# Altium schematic sheet Regulation.SchDoc
size A3
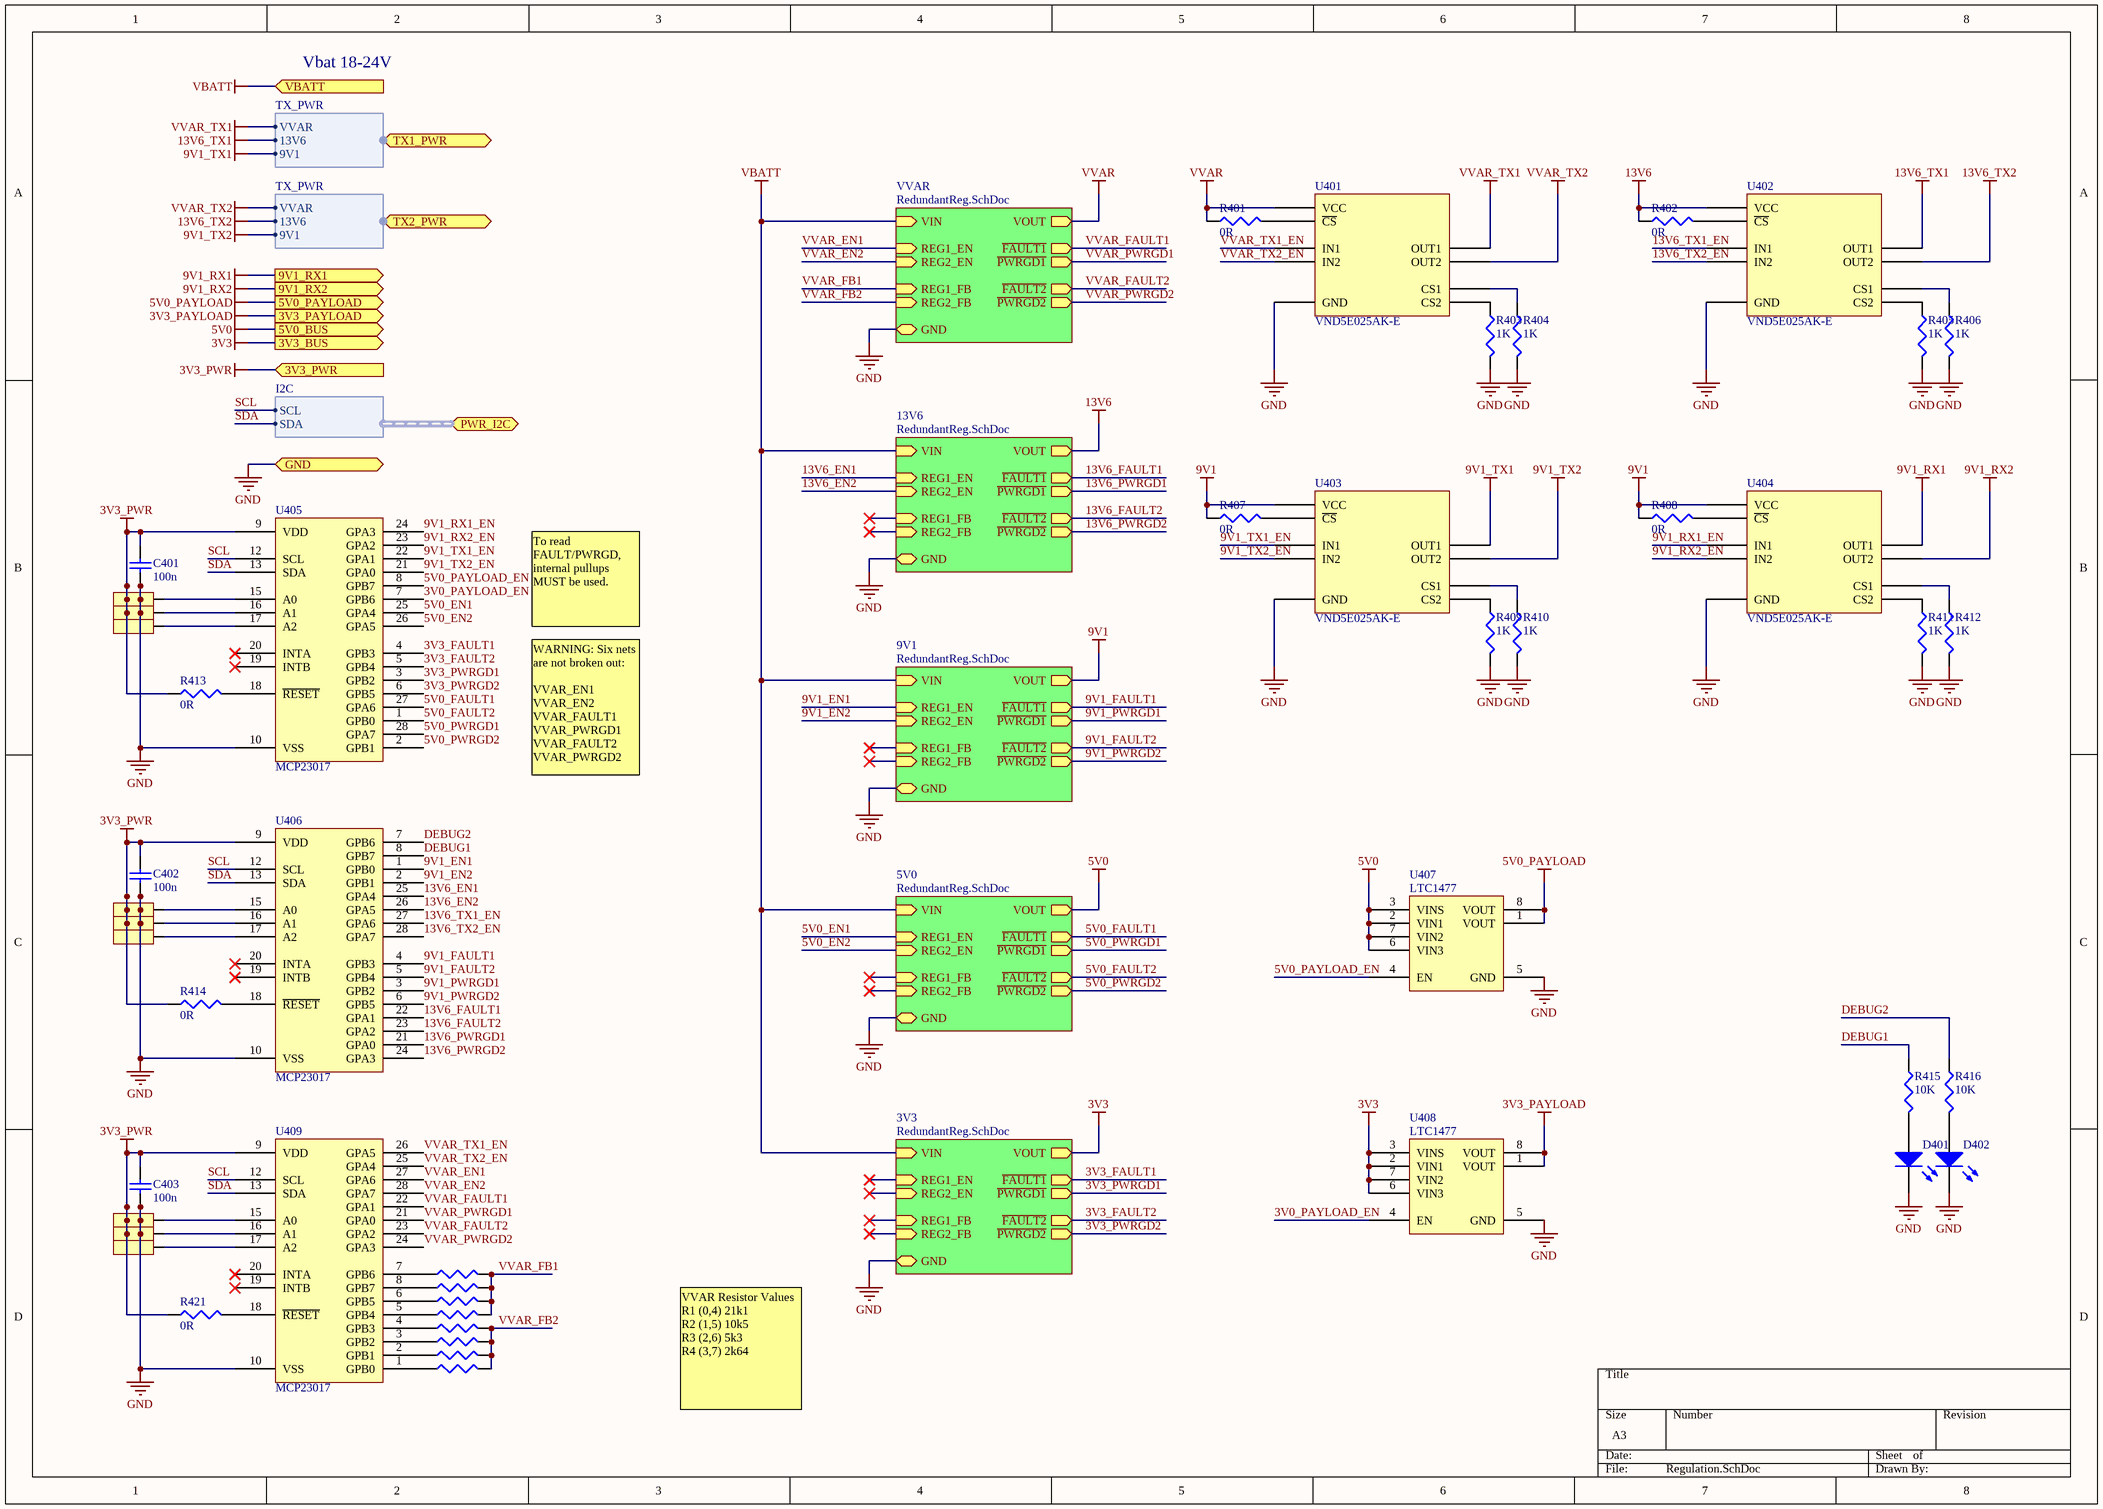
[diagram p0: Regulation.SchDoc]

## Parts
C401  value 100n  [R0805M]
C402  value 100n  [R0805M]
C403  value 100n  [R0805M]
D401  LED0  [R0805M]  (value not drawn)
D402  LED0  [R0805M]  (value not drawn)
J401  3-WAY JUMPER  [J1205M]  (value not drawn)
J402  3-WAY JUMPER  [J1205M]  (value not drawn)
J403  3-WAY JUMPER  [J1205M]  (value not drawn)
J404  3-WAY JUMPER  [J1205M]  (value not drawn)
J405  3-WAY JUMPER  [J1205M]  (value not drawn)
J406  3-WAY JUMPER  [J1205M]  (value not drawn)
J407  3-WAY JUMPER  [J1205M]  (value not drawn)
J408  3-WAY JUMPER  [J1205M]  (value not drawn)
J409  3-WAY JUMPER  [J1205M]  (value not drawn)
R401  value 0R  [R0402M]
R402  value 0R  [R0402M]
R403  value 1K  [R0402M]
R404  value 1K  [R0402M]
R405  value 1K  [R0402M]
R406  value 1K  [R0402M]
R407  value 0R  [R0402M]
R408  value 0R  [R0402M]
R409  value 1K  [R0402M]
R410  value 1K  [R0402M]
R411  value 1K  [R0402M]
R412  value 1K  [R0402M]
R413  value 0R  [R0402M]
R414  value 0R  [R0402M]
R415  value 10K  [R0402M]
R416  value 10K  [R0402M]
R417  VSET_1  [R0805M]  (value not drawn)
R418  VSET_1  [R0805M]  (value not drawn)
R419  VSET_1  [R0805M]  (value not drawn)
R420  VSET_1  [R0805M]  (value not drawn)
R421  value 0R  [R0402M]
R422  VSET_1  [R0805M]  (value not drawn)
R423  VSET_1  [R0805M]  (value not drawn)
R424  VSET_1  [R0805M]  (value not drawn)
R425  VSET_1  [R0805M]  (value not drawn)
U401  VND5E025AK-E  [SSO24]
U402  VND5E025AK-E  [SSO24]
U403  VND5E025AK-E  [SSO24]
U404  VND5E025AK-E  [SSO24]
U405  MCP23017  [SSOP28]
U406  MCP23017  [SSOP28]
U407  LTC1477  [SO8]
U408  LTC1477  [SO8]
U409  MCP23017  [SSOP28]

## Sub-sheets
3V3 = RedundantReg.SchDoc: REG1_EN (in), REG2_EN (in), VIN (in), VOUT (out), REG1_FB (in), REG2_FB (in), GND, ~{FAULT1} (out), ~{FAULT2} (out), ~{PWRGD1} (out), ~{PWRGD2} (out)  | Converter_IC_Variant: LMZ14203EXT; Value_Cout: 22uF; Value_Cout2: 22uF; Value_Isense: 0R10; Value_ON1: 10k13; Value_ON2: 3k13; Value_RFBB: 1k; Value_RFBT: 3k13; Value_RON: 51k1
5V0 = RedundantReg.SchDoc: REG1_EN (in), REG2_EN (in), VIN (in), VOUT (out), REG1_FB (in), REG2_FB (in), GND, ~{FAULT1} (out), ~{FAULT2} (out), ~{PWRGD1} (out), ~{PWRGD2} (out)  | Converter_IC_Varient: LMZ14203H/EXT; Value_Cout: 22uF; Value_Cout2: 22uF; Value_Isense: 0R10; Value_ON1: 10k; Value_ON2: 26k4; Value_RFBB: 1k; Value_RFBT: 5k23; Value_RON: 76k8
9V1 = RedundantReg.SchDoc: REG1_EN (in), REG2_EN (in), VIN (in), VOUT (out), REG1_FB (in), REG2_FB (in), GND, ~{FAULT1} (out), ~{FAULT2} (out), ~{PWRGD1} (out), ~{PWRGD2} (out)  | Convertor_IC_Variant: LMZ14203H; Value_Cout: 22uF; Value_Cout2: 22uF; Value_Isense: 0R10; Value_ON1: 10k; Value_ON2: 59k6; Value_RFBB: 1k; Value_RFBT: 10k38; Value_RON: 164k
13V6 = RedundantReg.SchDoc: REG1_EN (in), REG2_EN (in), VIN (in), VOUT (out), REG1_FB (in), REG2_FB (in), GND, ~{FAULT1} (out), ~{FAULT2} (out), ~{PWRGD1} (out), ~{PWRGD2} (out)  | Convertor_IC_Variant: LMZ14203H; Value_Cout: 22uF; Value_Cout2: 22uF; Value_Isense: 0R10; Value_ON1: 10k; Value_ON2: 95k25; Value_RFBB: 1k; Value_RFBT: 16k; Value_RON: 274k
VVAR = RedundantReg.SchDoc: REG1_EN (in), REG2_EN (in), VIN (in), VOUT (out), REG1_FB (in), REG2_FB (in), GND, ~{FAULT1} (out), ~{FAULT2} (out), ~{PWRGD1} (out), ~{PWRGD2} (out)  | Value_RON: 274k; Value_RFBB: 3k45; Value_RFBT: 16k; Value_Cout: 22uF; Value_ON1: 10k; Value_ON2: 22k4; Value_Isense: 0R10; Value_Cout2: 22uF; Converter_IC_Variant: LMZ14203H

## Ports
3V3_BUS (out), 3V3_PAYLOAD (out), 3V3_PWR (in), 5V0_BUS (out), 5V0_PAYLOAD (out), 9V1_RX1 (out), 9V1_RX2 (out), GND, PWR_I2C (harness I2C), TX1_PWR (harness TX_PWR), TX2_PWR (harness TX_PWR), VBATT (in)

## Harnesses
I2C: SCL, SDA
TX_PWR: VVAR, 13V6, 9V1

## Nets
3V3: U408.2(VIN1) U408.3(VINS) U408.6(VIN3) U408.7(VIN2) ; port 3V3_BUS, sheet 3V3/VOUT
3V3_PAYLOAD: U408.1(VOUT) U408.8(VOUT) ; port 3V3_PAYLOAD
3V3_PWR: C401.1 C402.1 C403.1 J401.1 J402.1 J403.1 J404.1 J405.1 J406.1 J407.1 J408.1 J409.1 R413.1 R414.1 R421.1 U405.9(VDD) U406.9(VDD) U409.9(VDD) ; port 3V3_PWR
5V0: U407.2(VIN1) U407.3(VINS) U407.6(VIN3) U407.7(VIN2) ; port 5V0_BUS, sheet 5V0/VOUT
5V0_PAYLOAD: U407.1(VOUT) U407.8(VOUT) ; port 5V0_PAYLOAD
9V1: R407.1 R408.1 U403.VCC U404.VCC ; sheet 9V1/VOUT
9V1_RX1: U404.OUT1 ; port 9V1_RX1
9V1_RX2: U404.OUT2 ; port 9V1_RX2
9V1_TX1: U403.OUT1 ; port TX1_PWR.9V1
9V1_TX2: U403.OUT2 ; port TX2_PWR.9V1
13V6: R402.1 U402.VCC ; sheet 13V6/VOUT
13V6_TX1: U402.OUT1 ; port TX1_PWR.13V6
13V6_TX2: U402.OUT2 ; port TX2_PWR.13V6
GND: C401.2 C402.2 C403.2 D401.2(K) D402.2(K) J401.3 J402.3 J403.3 J404.3 J405.3 J406.3 J407.3 J408.3 J409.3 R403.2 R404.2 R405.2 R406.2 R409.2 R410.2 R411.2 R412.2 U401.GND U402.GND U403.GND U404.GND U405.10(VSS) U406.10(VSS) U407.5(GND) U408.5(GND) U409.10(VSS) ; port GND, sheet 13V6/GND, sheet 9V1/GND, sheet 5V0/GND, sheet 3V3/GND, sheet VVAR/GND
VBATT: port VBATT, sheet 13V6/VIN, sheet 9V1/VIN, sheet 5V0/VIN, sheet 3V3/VIN, sheet VVAR/VIN
VVAR: R401.1 U401.VCC ; sheet VVAR/VOUT
VVAR_TX1: U401.OUT1 ; port TX1_PWR.VVAR
VVAR_TX2: U401.OUT2 ; port TX2_PWR.VVAR
3V0_PAYLOAD_EN: U405.7(GPB6) U408.4(EN)
3V3_FAULT1: U405.4(GPB3) ; sheet 3V3/~{FAULT1}
3V3_FAULT2: U405.5(GPB4) ; sheet 3V3/~{FAULT2}
3V3_PWRGD1: U405.3(GPB2) ; sheet 3V3/~{PWRGD1}
3V3_PWRGD2: U405.6(GPB5) ; sheet 3V3/~{PWRGD2}
5V0_EN1: U405.25(GPA4) ; sheet 5V0/REG1_EN
5V0_EN2: U405.26(GPA5) ; sheet 5V0/REG2_EN
5V0_FAULT1: U405.27(GPA6) ; sheet 5V0/~{FAULT1}
5V0_FAULT2: U405.1(GPB0) ; sheet 5V0/~{FAULT2}
5V0_PAYLOAD_EN: U405.8(GPB7) U407.4(EN)
5V0_PWRGD1: U405.28(GPA7) ; sheet 5V0/~{PWRGD1}
5V0_PWRGD2: U405.2(GPB1) ; sheet 5V0/~{PWRGD2}
9V1_EN1: U406.1(GPB0) ; sheet 9V1/REG1_EN
9V1_EN2: U406.2(GPB1) ; sheet 9V1/REG2_EN
9V1_FAULT1: U406.4(GPB3) ; sheet 9V1/~{FAULT1}
9V1_FAULT2: U406.5(GPB4) ; sheet 9V1/~{FAULT2}
9V1_PWRGD1: U406.3(GPB2) ; sheet 9V1/~{PWRGD1}
9V1_PWRGD2: U406.6(GPB5) ; sheet 9V1/~{PWRGD2}
9V1_RX1_EN: U404.IN1 U405.24(GPA3)
9V1_RX2_EN: U404.IN2 U405.23(GPA2)
9V1_TX1_EN: U403.IN1 U405.22(GPA1)
9V1_TX2_EN: U403.IN2 U405.21(GPA0)
13V6_EN1: U406.25(GPA4) ; sheet 13V6/REG1_EN
13V6_EN2: U406.26(GPA5) ; sheet 13V6/REG2_EN
13V6_FAULT1: U406.22(GPA1) ; sheet 13V6/~{FAULT1}
13V6_FAULT2: U406.23(GPA2) ; sheet 13V6/~{FAULT2}
13V6_PWRGD1: U406.21(GPA0) ; sheet 13V6/~{PWRGD1}
13V6_PWRGD2: U406.24(GPA3) ; sheet 13V6/~{PWRGD2}
13V6_TX1_EN: U402.IN1 U406.27(GPA6)
13V6_TX2_EN: U402.IN2 U406.28(GPA7)
DEBUG1: R415.1 U406.8(GPB7)
DEBUG2: R416.1 U406.7(GPB6)
SCL: U405.12(SCL) U406.12(SCL) U409.12(SCL) ; port PWR_I2C.SCL
SDA: U405.13(SDA) U406.13(SDA) U409.13(SDA) ; port PWR_I2C.SDA
VVAR_EN1: U409.27(GPA6) ; sheet VVAR/REG1_EN
VVAR_EN2: U409.28(GPA7) ; sheet VVAR/REG2_EN
VVAR_FAULT1: U409.22(GPA1) ; sheet VVAR/~{FAULT1}
VVAR_FAULT2: U409.23(GPA2) ; sheet VVAR/~{FAULT2}
VVAR_FB1: R417.2 R418.2 R419.2 R420.2 ; sheet VVAR/REG1_FB
VVAR_FB2: R422.2 R423.2 R424.2 R425.2 ; sheet VVAR/REG2_FB
VVAR_PWRGD1: U409.21(GPA0) ; sheet VVAR/~{PWRGD1}
VVAR_PWRGD2: U409.24(GPA3) ; sheet VVAR/~{PWRGD2}
VVAR_TX1_EN: U401.IN1 U409.26(GPA5)
VVAR_TX2_EN: U401.IN2 U409.25(GPA4)
NetD401_1: D401.1(A) R415.2
NetD402_1: D402.1(A) R416.2
NetJ401_2: J401.2 U405.15(A0)
NetJ402_2: J402.2 U405.16(A1)
NetJ403_2: J403.2 U405.17(A2)
NetJ404_2: J404.2 U406.15(A0)
NetJ405_2: J405.2 U406.16(A1)
NetJ406_2: J406.2 U406.17(A2)
NetJ407_2: J407.2 U409.15(A0)
NetJ408_2: J408.2 U409.16(A1)
NetJ409_2: J409.2 U409.17(A2)
NetR401_2: R401.2 U401.CS_DIS(~{CS})
NetR402_2: R402.2 U402.CS_DIS(~{CS})
NetR403_1: R403.1 U401.CS2
NetR404_1: R404.1 U401.CS1
NetR405_1: R405.1 U402.CS2
NetR406_1: R406.1 U402.CS1
NetR407_2: R407.2 U403.CS_DIS(~{CS})
NetR408_2: R408.2 U404.CS_DIS(~{CS})
NetR409_1: R409.1 U403.CS2
NetR410_1: R410.1 U403.CS1
NetR411_1: R411.1 U404.CS2
NetR412_1: R412.1 U404.CS1
NetR413_2: R413.2 U405.18(~{RESET})
NetR414_2: R414.2 U406.18(~{RESET})
NetR417_1: R417.1 U409.7(GPB6)
NetR418_1: R418.1 U409.8(GPB7)
NetR419_1: R419.1 U409.6(GPB5)
NetR420_1: R420.1 U409.5(GPB4)
NetR421_2: R421.2 U409.18(~{RESET})
NetR422_1: R422.1 U409.4(GPB3)
NetR423_1: R423.1 U409.3(GPB2)
NetR424_1: R424.1 U409.2(GPB1)
NetR425_1: R425.1 U409.1(GPB0)

Not connected (* = marked no-connect by the designer): U405 19(INTB)* 20(INTA)*; U406 19(INTB)* 20(INTA)*; U409 19(INTB)* 20(INTA)*

## Notes on the sheet
- Vbat 18-24V
- To read FAULT/PWRGD, internal pullups MUST be used.
- WARNING: Six nets are not broken out:
  VVAR_EN1
  VVAR_EN2
  VVAR_FAULT1
  VVAR_PWRGD1
  VVAR_FAULT2
  VVAR_PWRGD2
- VVAR Resistor Values
  R1 (0,4)	21k1
  R2 (1,5)	10k5
  R3 (2,6)	5k3
  R4 (3,7)	2k64

## Library data of the parts
C401-C403 = Cap: Capacitor; Published: 8-Jun-2000; LatestRevisionDate: 17-Jul-2002; LatestRevisionNote: Re-released for DXP Platform.; PackageReference: RAD-0.3; Publisher: Altium Limited; PackageDescription: Radial Cap, Thru-Hole; 2 Leads; 0.3 in Pin Spacing
D401 D402 = LED0: Typical INFRARED GaAs LED; Published: 8-Jun-2000; LatestRevisionDate: 08-Jul-2005; LatestRevisionNote: Mech Layer 1 removed.; PackageReference: LED-0; Publisher: Altium Limited; PackageDescription: LED; 2 Leads
R401-R425 = Res3: Resistor; Published: 8-Jun-2000; LatestRevisionDate: 29-May-2009; LatestRevisionNote: IPC-7351 Footprint Added.; PackageReference: J1-0603; Publisher: Altium Limited; PackageDescription: Chip Resistor
U401-U404 = VND5E025AK-E: Double channel high-side driver with analog current sense
U405 U406 U409 = MCP23017: 16-Bit I/O Expander with Serial Interface
U407 U408 = LTC1477: Single Protected High Side Switches